# Altium schematic sheet đề 08.SchDoc
size A2; SheetNumber: 1; SheetTotal: 1; SPICEModelCacheBWKDVYKP: <root> / <DocumentId>BWKDVYKP</DocumentId> / <CacheFrame Number="0"> / <Model Name="fuse" Kind="CKT"> / <Text>.SUBCKT FUSE 1 2 PARAMS: CURRENT=1 RESISTANCE=1m / SW1 1 2 3 0 SMOD OFF / BNLV 3 0 V=(abs(v(1,2))) / .MODEL SMOD SW (VT={(CURRENT*RESISTANCE)} RON=1g ROFF={RESISTANCE}) / .ENDS FUSE</Text> / </Model> / <Model Name="diode" Kind="MDL"> / <Text>*Default Diode / *Diode Pinout: A,K / .MODEL DIODE D()</Text> / </Model> / <Model Name="zener" Kind="MDL"> / <Text>*ZENER / *Default Zener 10V @ 10mA / *Zener Diode Pinout: A,K / .MODEL ZENER D( BV=10 IBV=10E-3 )</Text> / </Model> / <Model Name="irf1010" Kind="CKT"> / <Text>*IRF1010 MCE 4-2-96 / *55V  75A .014 ohm HEXFET pkg:TO-220 2,1,3 / .SUBCKT IRF1010  10 20 40 40 / M1   1  2  3  3  DMOS L=1U W=1U / RD  10  1  5.65M / RS  30  3  1.35M / RG  20  2  12.1 / CGS  2  3  2.15N / EGD 12  0  2  1  1 / VFB 14  0  0 / FFB  2  1  VFB  1 / CGD 13 14  4.49N / R1  13  0  1 / D1  12 13  DLIM / DDG 15 14  DCGD / R2  12 15  1 / D2  15  0  DLIM / DSD  3 10  DSUB / LS  30 40  7.5N / .MODEL DMOS NMOS (LEVEL=3 THETA=60M VMAX=114K ETA=2M VTO=3 KP=19.4) / .MODEL DCGD D (CJO=4.49N VJ=.6 M=.68) / .MODEL DSUB D (IS=311N N=1.5 RS=8.67M BV=55 CJO=4.08N VJ=.8 M=.42 TT=100N) / .MODEL DLIM D (IS=100U) / .ENDS IRF1010</Text> / </Model> / <Model Name="bridge" Kind="CKT"> / <Text>*Default Diode Bridge Rectifier / *Connections: / *              V- / *              | AC1 / *              | | V+ / *              | | | AC2 / *              | | | | / .SUBCKT BRIDGE 1 2 3 4 / D1 1 2 DMOD / D2 1 4 DMOD / D3 2 3 DMOD / D4 4 3 DMOD / .MODEL DMOD D () / .ENDS BRIDGE</Text> / </Model> / </CacheFrame> / </root>
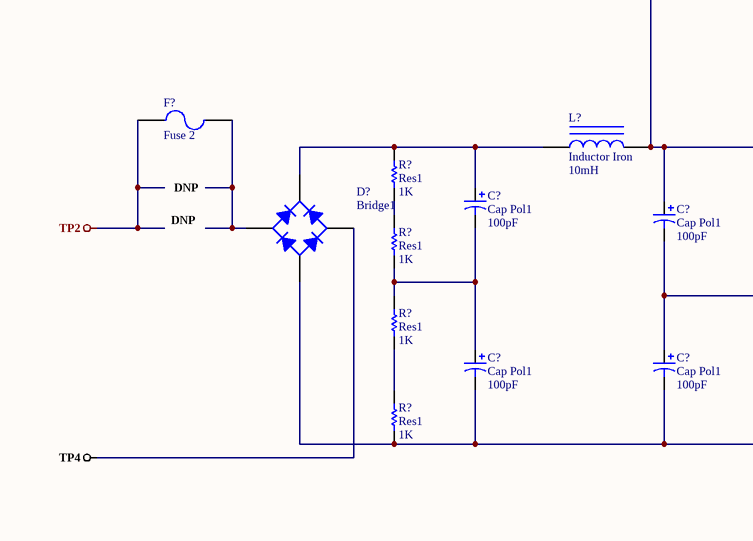
[diagram p0: đề 08.SchDoc, left]
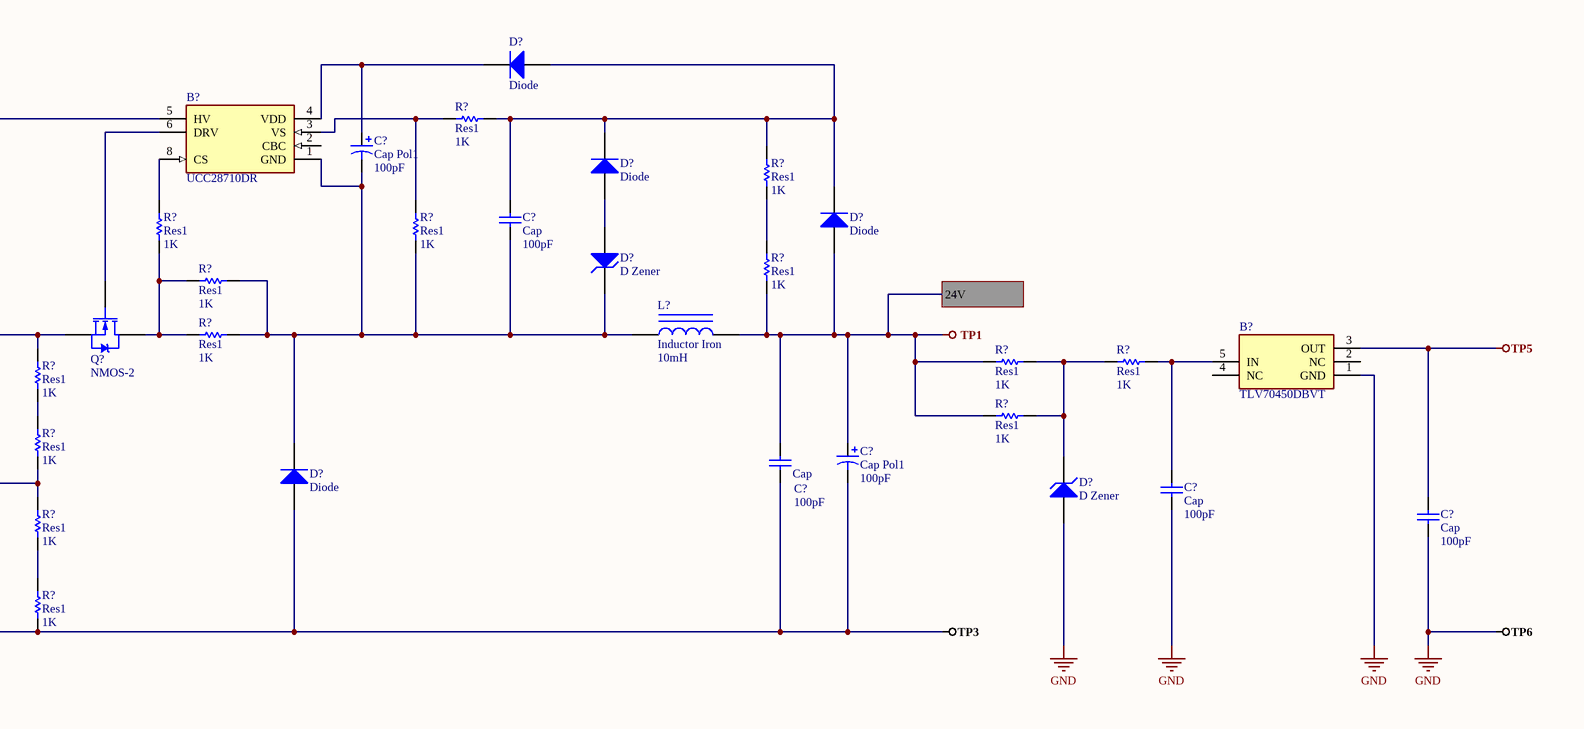
[diagram p1: đề 08.SchDoc, right]

## Parts
(Parts that share a designator on the sheet are numbered #1, #2 ... from top to bottom, then left to right.)
B?#1  UCC28710DR  [SOIC127P600X175-8N]
B?#2  TLV70450DBVT  [SOT95P280X145-5N]
C?#1  Cap Pol1  value 100pF  [RB7.6-15]
C?#2  Cap  value 100pF  [RAD-0.3]
C?#3  Cap Pol1  value 100pF  [RB7.6-15]
C?#4  Cap Pol1  value 100pF  [RB7.6-15]
C?#5  Cap Pol1  value 100pF  [RB7.6-15]
C?#6  Cap  value 100pF  [RAD-0.3]
C?#7  Cap  value 100pF  [RAD-0.3]
C?#8  Cap  value 100pF  [RAD-0.3]
C?#9  Cap Pol1  value 100pF  [RB7.6-15]
C?#10  Cap Pol1  value 100pF  [RB7.6-15]
D?#1  Diode  [SMC]
D?#2  Diode  [SMC]
D?#3  Diode  [SMC]
D?#4  D Zener  [DIODE-0.7]
D?#5  Bridge1  [D-38]
D?#6  Diode  [SMC]
D?#7  D Zener  [DIODE-0.7]
F?  Fuse 2  [PIN-W2/E2.8]
L?#1  Inductor Iron  value 10mH  [AXIAL-0.9]
L?#2  Inductor Iron  value 10mH  [AXIAL-0.9]
Q?  NMOS-2  [TO-220AB]
R?#1  Res1  value 1K  [AXIAL-0.3]
R?#2  Res1  value 1K  [AXIAL-0.3]
R?#3  Res1  value 1K  [AXIAL-0.3]
R?#4  Res1  value 1K  [AXIAL-0.3]
R?#5  Res1  value 1K  [AXIAL-0.3]
R?#6  Res1  value 1K  [AXIAL-0.3]
R?#7  Res1  value 1K  [AXIAL-0.3]
R?#8  Res1  value 1K  [AXIAL-0.3]
R?#9  Res1  value 1K  [AXIAL-0.3]
R?#10  Res1  value 1K  [AXIAL-0.3]
R?#11  Res1  value 1K  [AXIAL-0.3]
R?#12  Res1  value 1K  [AXIAL-0.3]
R?#13  Res1  value 1K  [AXIAL-0.3]
R?#14  Res1  value 1K  [AXIAL-0.3]
R?#15  Res1  value 1K  [AXIAL-0.3]
R?#16  Res1  value 1K  [AXIAL-0.3]
R?#17  Res1  value 1K  [AXIAL-0.3]
R?#18  Res1  value 1K  [AXIAL-0.3]

## Ports
24V

## Nets
 TP1: C?#5.1 C?#6.2 D?#3.1(A) L?#2.2 R?#5.1 R?#9.2 R?#12.2 ; port 24V
GND: B?#2.1(GND) C?#7.1 C?#8.1 D?#7.1(A)  [also labelled TP6]
TP2: F?.1
TP3: C?#5.2 C?#6.1 C?#9.2 C?#10.2 D?#5.3(A) D?#6.1(A) R?#17.1 R?#18.1
TP4: D?#5.2(C)
TP5: B?#2.3(OUT) C?#8.2
NetB?#1_1: B?#1.1(GND) C?#1.2 C?#2.1 D?#4.2(K) D?#6.2(K) L?#2.1 R?#4.2 R?#6.1 R?#7.1
NetB?#1_3: B?#1.3(VS) R?#1.1 R?#4.1
NetB?#1_4: B?#1.4(VDD) C?#1.1 D?#1.2(K)
NetB?#1_5: B?#1.5(HV) C?#4.1 L?#1.2 Q?.3(S) R?#11.2
NetB?#1_6: B?#1.6(DRV) Q?.1(G)
NetB?#1_8: B?#1.8(CS) R?#3.1
NetB?#2_5: B?#2.5(IN) C?#7.2 R?#10.1
NetC?#2_2: C?#2.2 D?#1.1(A) D?#2.2(K) D?#3.2(K) R?#1.2 R?#2.2
NetC?#3_1: C?#3.1 D?#5.1(K) L?#1.1 R?#8.2
NetC?#3_2: C?#3.2 C?#9.1 R?#13.1 R?#15.2
NetC?#4_2: C?#4.2 C?#10.1 R?#14.1 R?#16.2
NetD?#2_1: D?#2.1(A) D?#4.1(A)
NetD?#5_4: D?#5.4(C) F?.2
NetD?#7_2: D?#7.2(K) R?#9.1 R?#10.2 R?#12.1
NetQ?_2: Q?.2(D) R?#3.2 R?#6.2 R?#7.2
NetR?#2_1: R?#2.1 R?#5.2
NetR?#8_1: R?#8.1 R?#13.2
NetR?#11_1: R?#11.1 R?#14.2
NetR?#15_1: R?#15.1 R?#17.2
NetR?#16_1: R?#16.1 R?#18.2

Not connected (* = marked no-connect by the designer): B?#1 2(CBC); B?#2 2(NC) 4(NC)

## Notes on the sheet
- DNP

## Library data of the parts
B?#1 = UCC28710DR: Constant-Voltage, Constant-Current PWM Controller with Primary-Side Regulation; Manufacturer_Name: Texas Instruments; Geometry.Height: 1.75mm; Manufacturer_Part_Number: UCC28710DR; Mouser Part Number: 595-UCC28710DR; Mouser Price/Stock: https://www.mouser.co.uk/ProductDetail/Texas-Instruments/UCC28710DR?qs=T1E5mKGHTGXBTXx0kdQpWQ%3D%3D; Arrow Part Number: UCC28710DR; Arrow Price/Stock: https://www.arrow.com/en/products/ucc28710dr/texas-instruments?region=nac; Datasheet Link: http://www.ti.com/lit/ds/symlink/ucc28710.pdf
B?#2 = TLV70450DBVT: 24V 150mA Low IQ LDO Regulator SOT-23-5 Texas Instruments TLV70450DBVT, LDO Voltage Regulator, 150mA, 5 V; Geometry.Height: 1.45mm; Manufacturer_Name: Texas Instruments; Manufacturer_Part_Number: TLV70450DBVT; Mouser Part Number: 595-TLV70450DBVT; Mouser Price/Stock: https://www.mouser.co.uk/ProductDetail/Texas-Instruments/TLV70450DBVT?qs=O1HRStiETChf4U3Nno5bLA%3D%3D; Arrow Part Number: TLV70450DBVT; Arrow Price/Stock: https://www.arrow.com/en/products/tlv70450dbvt/texas-instruments?region=nac; Datasheet Link: http://www.ti.com/lit/ds/symlink/tlv704.pdf
C?#1 C?#3-C?#5 C?#9 C?#10 = Cap Pol1: Polarized Capacitor (Radial); Published: 8-Jun-2000; LatestRevisionDate: 17-Jul-2002; LatestRevisionNote: Re-released for DXP Platform.; PackageReference: RB7.6-15; Publisher: Altium Limited; PackageDescription: Polarized Capacitor (Radial); 2 Leads
C?#2 C?#6-C?#8 = Cap: Capacitor; Published: 8-Jun-2000; LatestRevisionDate: 17-Jul-2002; LatestRevisionNote: Re-released for DXP Platform.; PackageReference: RAD-0.3; Publisher: Altium Limited; PackageDescription: Radial Cap, Thru-Hole; 2 Leads; 0.3 in Pin Spacing
D?#1-D?#3 D?#6 = Diode: Default Diode; Published: 8-Jun-2000; LatestRevisionDate: 17-Jul-2002; LatestRevisionNote: Re-released for DXP Platform.; PackageVersion: Sep-1996; PackageReference: SMC; Publisher: Altium Limited; PackageDescription: DO-214-AB/SMC; 2 C-Bend Leads; Body 7.9 x 5.9 mm, inc. leads (LxW); Code_JEDEC: DO-214-AB
D?#4 D?#7 = D Zener: Zener Diode; Published: 8-Jun-2000; LatestRevisionDate: 17-Jul-2002; LatestRevisionNote: Re-released for DXP Platform.; PackageReference: DIODE-0.7; Publisher: Altium Limited; PackageDescription: Diode, Thru-Hole; 2 Leads; 0.7 in Pin Spacing
D?#5 = Bridge1: Full Wave Diode Bridge; Published: 8-Jun-2000; LatestRevisionDate: 29-May-2009; LatestRevisionNote: Sch pins A & K swapped.; DatasheetVersion: E2732B; PackageReference: D-38; Publisher: Altium Limited; PackageDescription: Bridge Rectifier; 4 Terminals; Body 9.4 x 9.4 mm (typ); Pitch 5.08 mm
F? = Fuse 2: Fuse; Published: 8-Jun-2000; LatestRevisionDate: 17-Jul-2002; LatestRevisionNote: Re-released for DXP Platform.; PackageReference: PIN-W2/E2.8; Publisher: Altium Limited; PackageDescription: Thru-Hole; 2 Leads
L?#1 L?#2 = Inductor Iron: Magnetic-Core Inductor; Published: 24-Mar-1999; LatestRevisionDate: 17-Jul-2002; LatestRevisionNote: Re-released for DXP Platform.; PackageReference: AXIAL-0.9; Publisher: Altium Limited; PackageDescription: Axial Device, Thru-Hole; 2 Leads; 0.9 in Pin Spacing
Q? = NMOS-2: N-Channel Power MOSFET; Note: Pin 2 is electrically connected to pin 4.; Published: 8-Jun-2000; LatestRevisionDate: 17-Jul-2002; LatestRevisionNote: Re-released for DXP Platform.; DatasheetVersion: PD-9.814; PackageVersion: Feb-1997; PackageReference: TO-220AB; Publisher: Altium Limited; PackageDescription: TO, Thru-Hole, Vertical, Heatsink Mounted; 3 In-Line Leads; Pitch 2.54 mm; ComponentLink1Description: Manufacturer Link; ComponentLink1URL: http://www.irf.com/
R?#1-R?#18 = Res1: Resistor; Published: 8-Jun-2000; LatestRevisionDate: 17-Jul-2002; LatestRevisionNote: Re-released for DXP Platform.; PackageReference: AXIAL-0.3; Publisher: Altium Limited; PackageDescription: Axial Device, Thru-Hole; 2 Leads; 0.3 in Pin Spacing